# Altium schematic sheet AD637-有效值检测新版.SchDoc
size A4
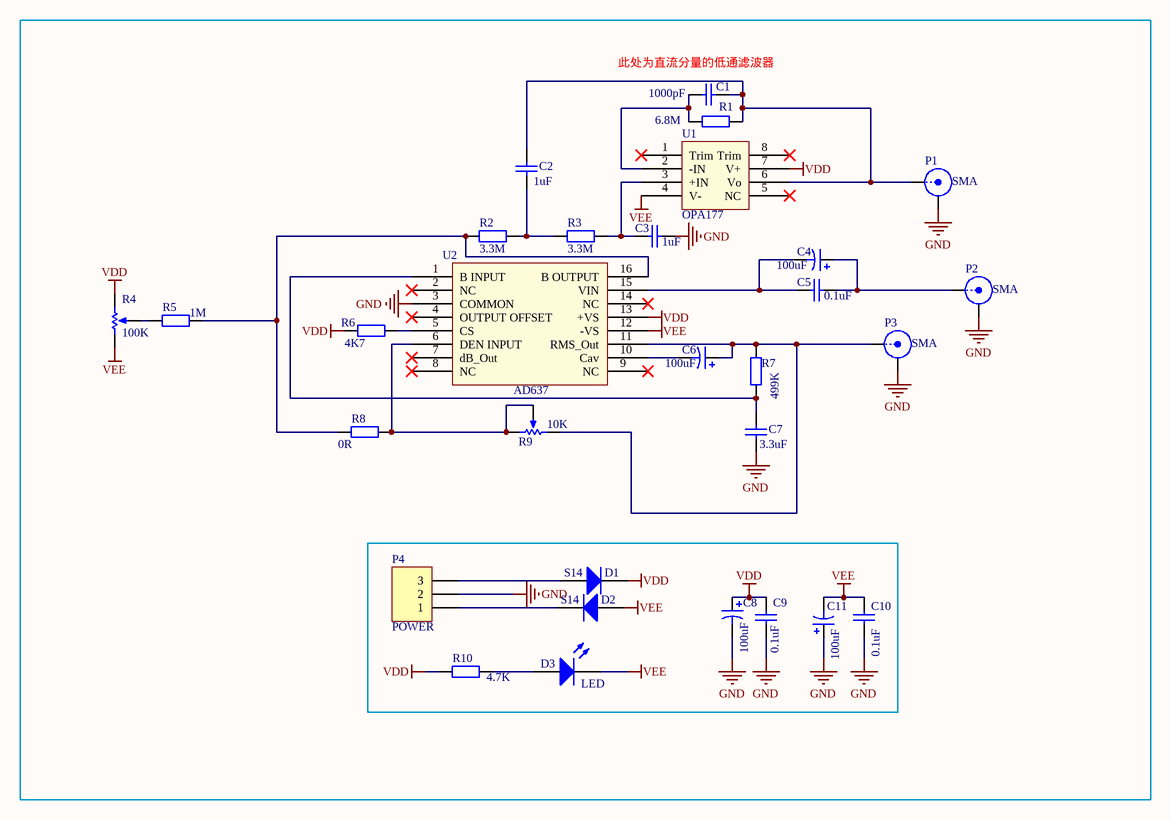
[diagram p0: AD637-有效值检测新版.SchDoc]

## Parts
C1  value 1000pF  [C0805]
C2  value 1uF  [C0805]
C3  value 1uF  [C0805]
C4  value 100uF  [C7343]
C5  value 0.1uF  [C0805]
C6  value 100uF  [C7343]
C7  value 3.3uF  [C0805]
C8  value 100uF  [C7343]
C9  value 0.1uF  [C0805]
C10  value 0.1uF  [C0805]
C11  value 100uF  [C7343]
D1  S14  [SOD123]
D2  S14  [SOD123]
D3  LED  [LED0805R]
P1  SMA  [SM]
P2  SMA  [SM]
P3  SMA  [SM]
P4  POWER  [3PIN-5.08B]
R1  value 6.8M  [R0805]
R2  value 3.3M  [R0805]
R3  value 3.3M  [R0805]
R4  value 100K  [3296W]
R5  value 1M  [R0805]
R6  value 4K7  [R0805]
R7  value 499K  [R0805]
R8  value 0R  [R0805]
R9  value 10K  [3296W]
R10  value 4.7K  [R0805]
U1  OPA177  [SOP8]
U2  AD637  [AD637]

## Blocks framed on the sheet
此处为直流分量的低通滤波器: C1-C11 D1-D3 P1-P4 R1-R10 U1 U2

## Nets
GND: C3.1 C7.1 C8.2 C9.1 C10.1 C11.1 P1.2(Y) P2.2(Y) P3.2(Y) P4.2 U2.3(COMMON)
VDD: C8.1 C9.2 D1.2(K) R4.2(BOT) R6.1 R10.1 U1.7(V+) U2.13(+VS)
VEE: C10.2 C11.2 D2.1(A) D3.2 R4.1(TOP) U1.4(V-) U2.12(-VS)
NetC1_1: C1.1 C2.1 P1.1(X) R1.2 U1.6(Vo)
NetC1_2: C1.2 R1.1 U1.2(-IN)
NetC2_2: C2.2 R2.2 R3.1
NetC3_2: C3.2 R3.2 U1.3(+IN)
NetC4_1: C4.1 C5.1 P2.1(X)
NetC4_2: C4.2 C5.2 U2.15(VIN)
NetC6_1: C6.1 P3.1(X) R7.2 R9.1(TOP) U2.11(RMS_Out)
NetC6_2: C6.2 U2.10(Cav)
NetC7_2: C7.2 R7.1 U2.1(B_INPUT)
NetD1_1: D1.1(A) P4.3
NetD2_2: D2.2(K) P4.1
NetD3_1: D3.1 R10.2
NetR2_1: R2.1 R5.2 R8.1 U2.16(B_OUTPUT)
NetR4_3: R4.3(TAP) R5.1
NetR6_2: R6.2 U2.5(CS)
NetR8_2: R8.2 R9.2(BOT) R9.3(TAP) U2.6(DEN_INPUT)

Not connected (* = marked no-connect by the designer): U1 1(Trim)* 5(NC)* 8(Trim)*; U2 2(NC)* 4(OUTPUT_OFFSET)* 7(dB_Out)* 8(NC)* 9(NC)* 14(NC)*

## Notes on the sheet
- Title:
- Project:
- Size:
- A4
- Revision:
- Author:
- 成都菁威
- 科技
- Data:
- Company:

## Library data of the parts
C1-C3 C5 C7 C9 C10 = Cap: Capacitor; Published: 8-Jun-2000; LatestRevisionDate: 17-Jul-2002; LatestRevisionNote: Re-released for DXP Platform.; PackageReference: RAD-0.3; Publisher: Altium Limited; PackageDescription: Radial Cap, Thru-Hole; 2 Leads; 0.3 in Pin Spacing
C4 C6 C8 C11 = Cap Pol1: Polarized Capacitor (Radial); Published: 8-Jun-2000; LatestRevisionDate: 17-Jul-2002; LatestRevisionNote: Re-released for DXP Platform.; PackageReference: RB7.6-15; Publisher: Altium Limited; PackageDescription: Polarized Capacitor (Radial); 2 Leads
D1 D2 = Diode 1N4007: 1 Amp General Purpose Rectifier; Published: 8-Jun-2000; LatestRevisionDate: 17-Jul-2002; LatestRevisionNote: Re-released for DXP Platform.; DatasheetVersion: 1998; PackageVersion: Aug-1999; PackageReference: DO-41; Publisher: Altium Limited; PackageDescription: Diode, Axial; Body 5.2 x 2.7 mm (LxDia. max), Lead Dia. 0.86 mm (max); Code_JEDEC: DO-204-AL; ComponentLink1Description: Manufacturer Link; ComponentLink1URL: http://www.fairchildsemi.com/; ComponentLink2Description: Datasheet; ComponentLink2URL: http://www.fairchildsemi.com/ds/1N%2F1N4001.pdf
P1-P3 = BNC: BNC Elbow Connector; LatestRevisionDate: 17-Jul-2002; LatestRevisionNote: Re-released for DXP Platform.; Publisher: Altium Limited
P4 = Header 3: Header, 3-Pin; LatestRevisionDate: 17-Jul-2002; LatestRevisionNote: Re-released for DXP Platform.; Publisher: Altium Limited
R1-R3 R5-R8 R10 = Res2: Resistor; Published: 8-Jun-2000; LatestRevisionDate: 17-Jul-2002; LatestRevisionNote: Re-released for DXP Platform.; PackageReference: AXIAL-0.4; Publisher: Altium Limited; PackageDescription: Axial Device, Thru-Hole; 2 Leads; 0.4 in Pin Spacing
R4 R9 = RPot: Potentiometer; Sim Note: Enter the Resistance value and the set point into parameter fields.; Set Position: 0.5; Published: 8-Jun-2000; LatestRevisionDate: 17-Jul-2002; LatestRevisionNote: Re-released for DXP Platform.; PackageReference: VR5; Publisher: Altium Limited; PackageDescription: Variable Resistor, Thru-Hole; 3 Leads
D3 = LED: Published: 8-Jun-2000; LatestRevisionDate: 08-Jul-2005; LatestRevisionNote: Mech Layer 1 removed.; PackageReference: LED-0; Publisher: Altium Limited; PackageDescription: LED; 2 Leads